# EAGLE schematic Secondary_PCB_Schematic (EAGLE 9.7.0)
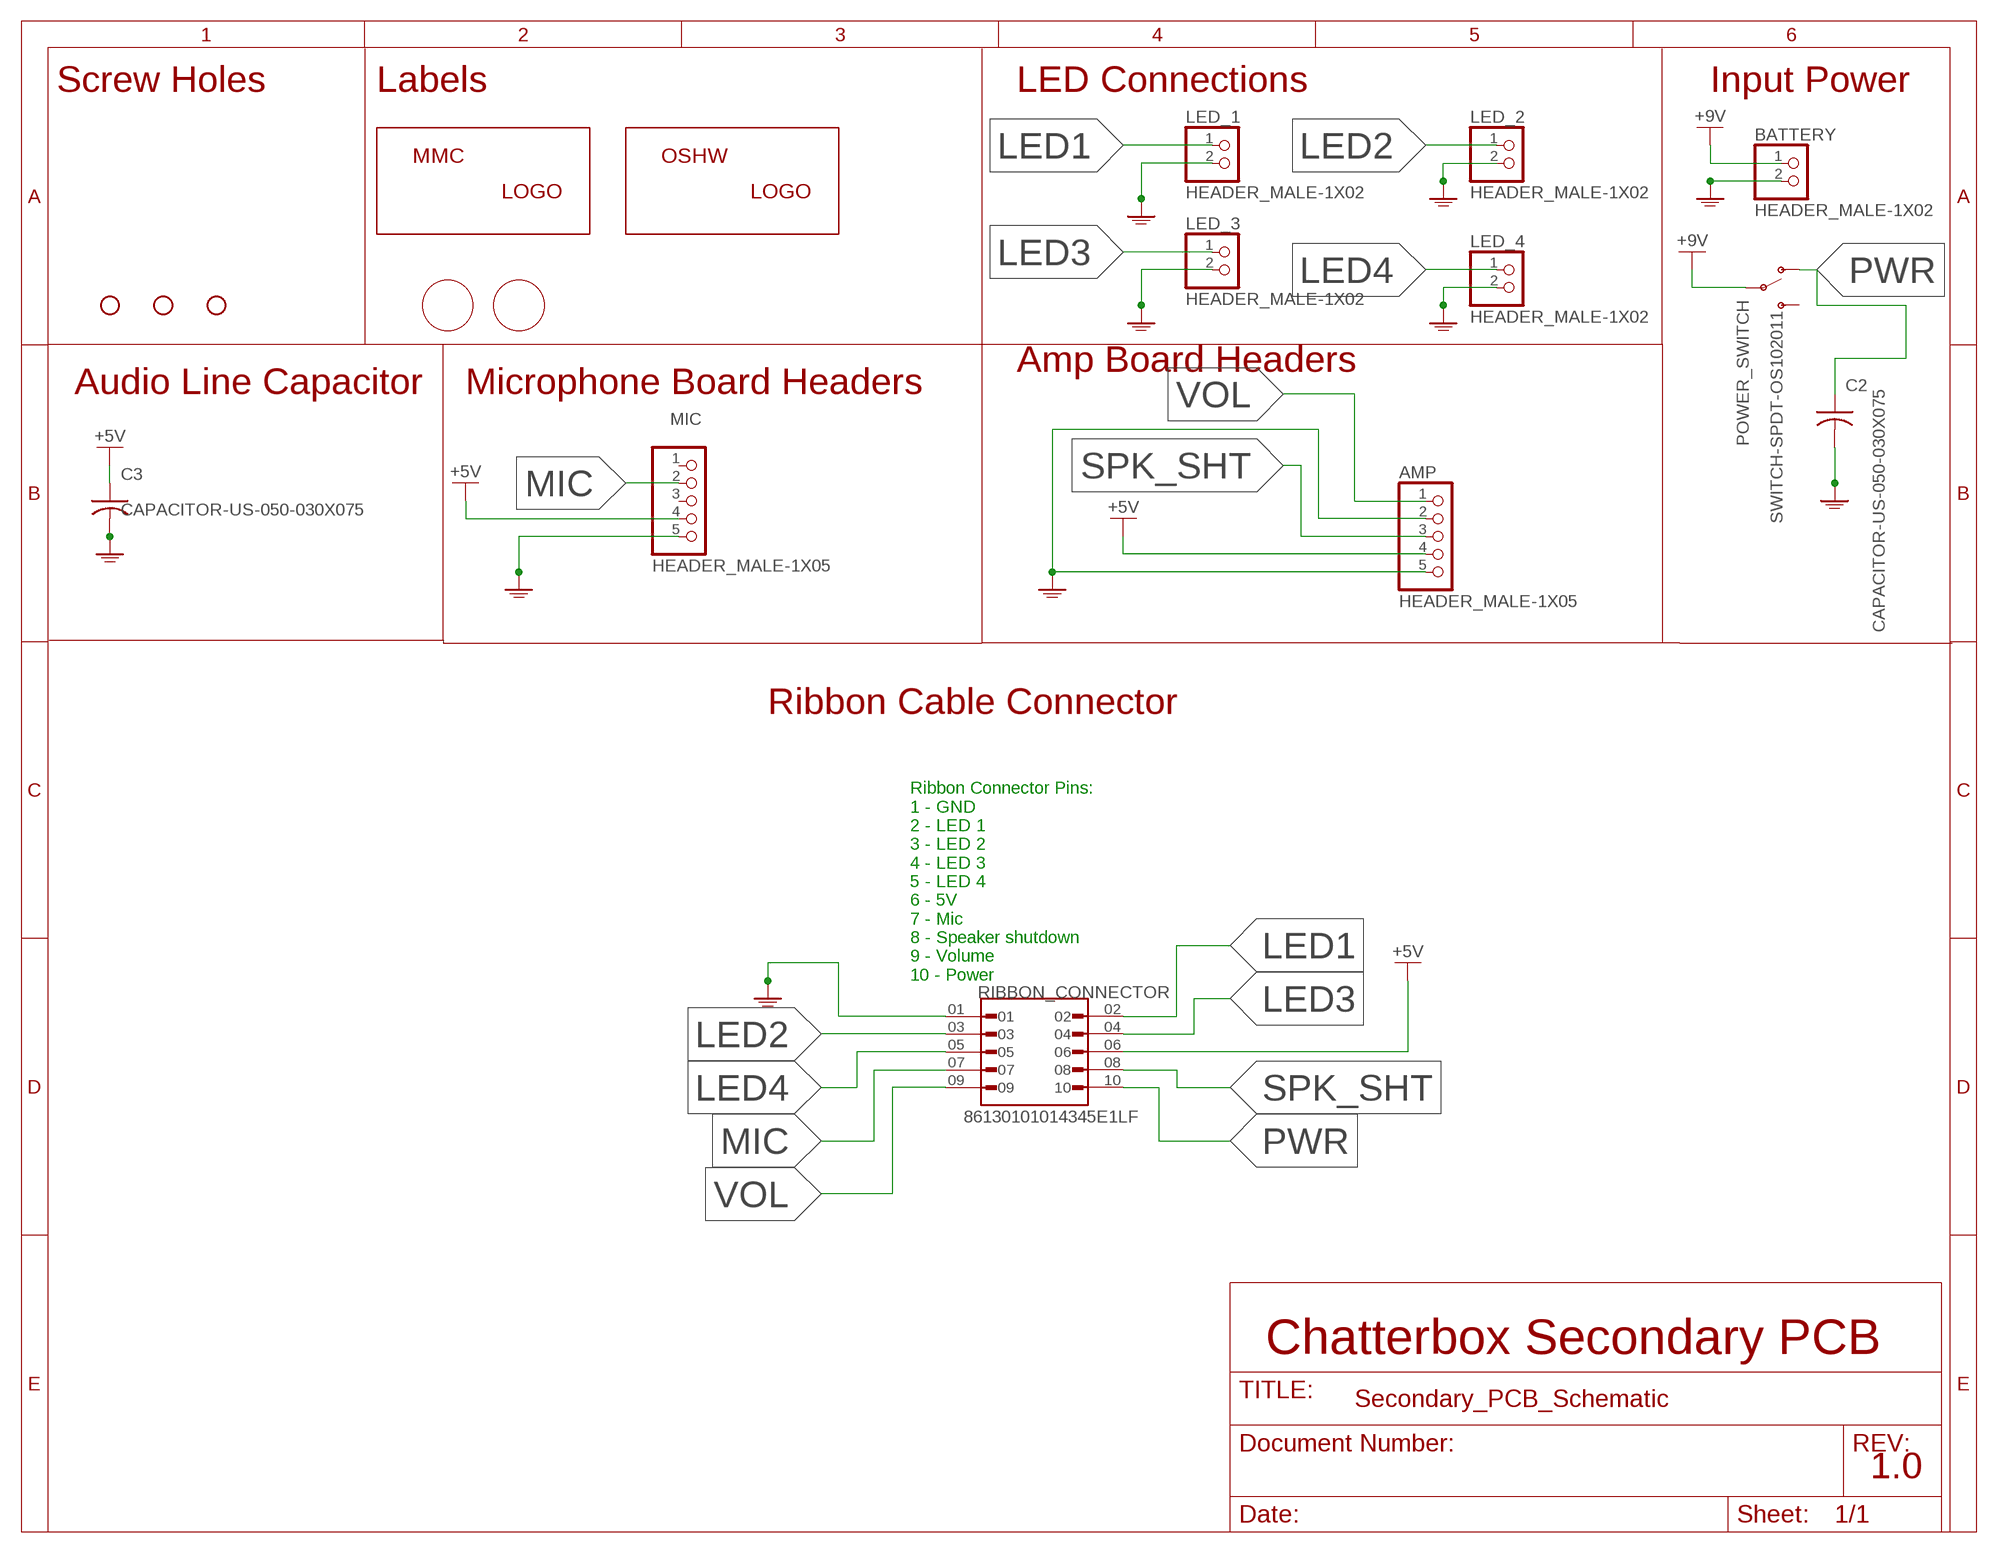
[diagram p0: schematic, sheet 1]

## Parts
AMP  HEADER_MALE-1X05  [HEADER_MALE-1X05]
BATTERY  HEADER_MALE-1X02  [HEADER_MALE-1X02]
C2  CAPACITOR-US-050-030X075  [CAP-050-030X075]
C3  CAPACITOR-US-050-030X075  [CAP-050-030X075]
LED_1  HEADER_MALE-1X02  [HEADER_MALE-1X02]
LED_2  HEADER_MALE-1X02  [HEADER_MALE-1X02]
LED_3  HEADER_MALE-1X02  [HEADER_MALE-1X02]
LED_4  HEADER_MALE-1X02  [HEADER_MALE-1X02]
MIC  HEADER_MALE-1X05  [HEADER_MALE-1X05]
POWER_SWITCH  SWITCH-SPDT-OS102011  [SWITCH_SPDT_11MA1QS1]
RIBBON_CONNECTOR  86130101014345E1LF  [AMPHENOL_86130101014345E1LF]
U$1  MMC_LOGO-SM  [MMC_SMALL_LOGO]
U$2  OSHW_LOGO-SM  [OSHW_SMALL_LOGO]
U$3  MMC_LABEL-BACK  [LABEL-BACK]
U$4  MMC_LABEL-FRONT  [LABEL-FRONT]
U$17  STAND-OFF-  [STAND-OFF]
U$18  STAND-OFF-  [STAND-OFF]
U$19  STAND-OFF-  [STAND-OFF]

## Nets
+5V: AMP.4 C3.1 MIC.4 RIBBON_CONNECTOR.06
+9V: BATTERY.1 POWER_SWITCH.2(P)
GND1: AMP.2 AMP.5 BATTERY.2 C2.2 C3.2 LED_1.2 LED_2.2 LED_3.2 LED_4.2 MIC.5 RIBBON_CONNECTOR.01 ; supply symbol labelled GND
LED1: LED_1.1 RIBBON_CONNECTOR.02
LED2: LED_2.1 RIBBON_CONNECTOR.03
LED3: LED_3.1 RIBBON_CONNECTOR.04
LED4: LED_4.1 RIBBON_CONNECTOR.05
MIC: MIC.2 RIBBON_CONNECTOR.07
PWR: C2.1 POWER_SWITCH.1(O) RIBBON_CONNECTOR.10
SPK_SHT: AMP.3 RIBBON_CONNECTOR.08
VOL: AMP.1 RIBBON_CONNECTOR.09
Unconnected: MIC.1 MIC.3 POWER_SWITCH.3(S)

## Notes on the sheet
- Screw Holes | Labels | LED Connections | Input Power
- Amp Board Headers
- Audio Line Capacitor | Microphone Board Headers
- Ribbon Cable Connector
- Ribbon Connector Pins:
  1 - GND
  2 - LED 1
  3 - LED 2
  4 - LED 3
  5 - LED 4
  6 - 5V
  7 - Mic
  8 - Speaker shutdown
  9 - Volume
  10 - Power
- Chatterbox Secondary PCB
- 1.0

## Library data of the parts
AMP MIC = MMC_Eagle:HEADER_MALE-1X05
BATTERY LED_1-LED_4 = MMC_Eagle:HEADER_MALE-1X02
C2 C3 = MMC_Eagle:CAPACITOR-US-
POWER_SWITCH = MMC_Eagle:SWITCH-SPDT-
RIBBON_CONNECTOR = 86130101014345E1LF:86130101014345E1LF; MANUFACTURER: Amphenol; PARTREV: C; STANDARD: Manufacturer Recommendations
U$1 = MMC_Eagle:MMC_LOGO-
U$2 = MMC_Eagle:OSHW_LOGO-
U$3 U$4 = MMC_Eagle:MMC_LABEL-
U$17-U$19 = MMC_Eagle:STAND-OFF-